# Altium schematic sheet CW308_IMXRT1062_UFO.SchDoc: CW308 Connections
size Letter; Organization: NewAE Technology Inc.; Address1: 1083 Queen St., Suite 196; Address2: Halifax; Address3: NS; Address4: Canada B3H 0B2; SheetNumber: 2; SheetTotal: 2; SheetApproved: NO
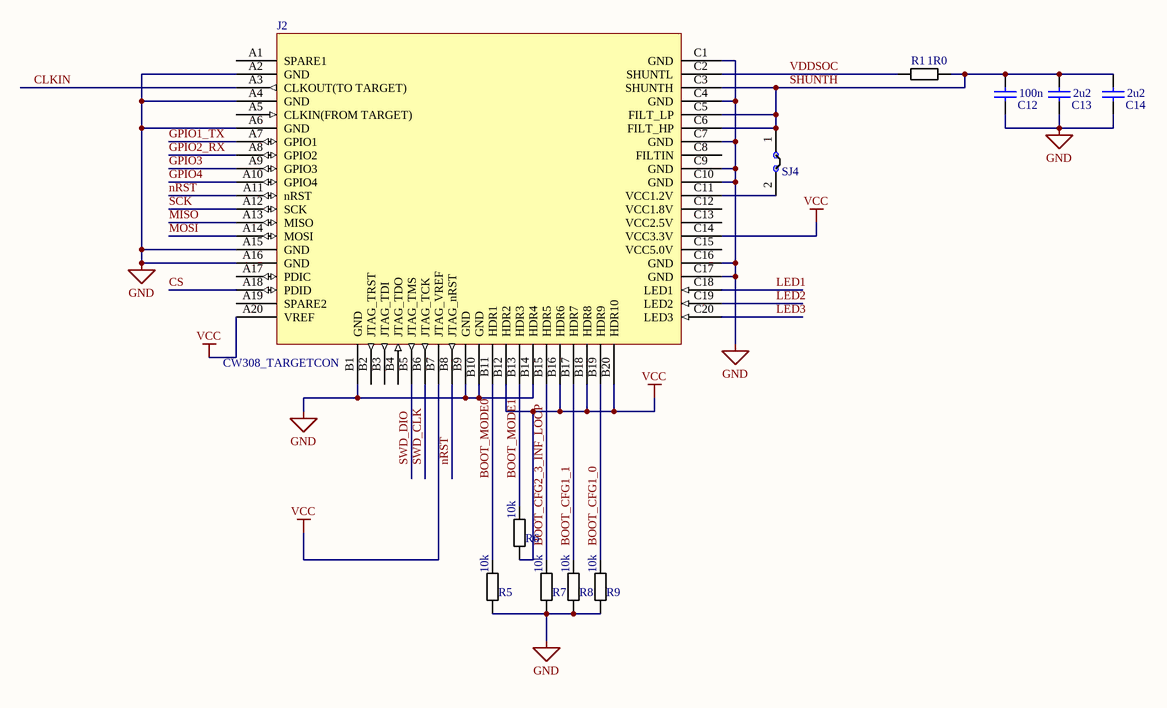
[diagram p0: CW308_IMXRT1062_UFO.SchDoc]

## Parts
C12  100n  [CAPC0603_M]
C13  2u2  [CAPC0603_M]
C14  2u2  [CAPC0603_M]
J2  CW308_TARGETCON  [CW308_TBOARD_CONN]
R1  1R0  [RESC1608X55N]
R5  10k  [RESC1608X55N]
R6  10k  [RESC1608X55N]
R7  10k  [RESC1608X55N]
R8  10k  [RESC1608X55N]
R9  10k  [RESC1608X55N]
SJ4  NC  [SJ_2S_NC]  (value not drawn)  (no BOM)

## Nets
GND: C12.2 C13.2 C14.2 J2.A2(GND) J2.A4(GND) J2.A6(GND) J2.A15(GND) J2.A16(GND) J2.B1(GND) J2.B9(GND) J2.B10(GND) J2.B14(HDR4) J2.C1(GND) J2.C4(GND) J2.C7(GND) J2.C9(GND) J2.C10(GND) J2.C16(GND) J2.C17(GND) R5.2 R7.2 R8.2 R9.1
VCC: J2.A20(VREF) J2.B7(JTAG_VREF) J2.B12(HDR2) J2.B16(HDR6) J2.B18(HDR8) J2.B20(HDR10) J2.C14(VCC3.3V) R6.2
BOOT_CFG1_0: J2.B19(HDR9) R9.2
BOOT_CFG1_1: J2.B17(HDR7) R8.1
BOOT_CFG2_3_INF_LOOP: J2.B15(HDR5) R7.1
BOOT_MODE0: J2.B11(HDR1) R5.1
BOOT_MODE1: J2.B13(HDR3) R6.1
CLKIN: J2.A3(CLKOUT(TO_TARGET))
CS: J2.A18(PDID)
GPIO1_TX: J2.A7(GPIO1)
GPIO2_RX: J2.A8(GPIO2)
GPIO3: J2.A9(GPIO3)
GPIO4: J2.A10(GPIO4)
LED1: J2.C18(LED1)
LED2: J2.C19(LED2)
LED3: J2.C20(LED3)
MISO: J2.A13(MISO)
MOSI: J2.A14(MOSI)
nRST: J2.A11(nRST) J2.B8(JTAG_nRST)
SCK: J2.A12(SCK)
SHUNTH: C12.1 C13.1 C14.1 J2.C3(SHUNTH) J2.C5(FILT_LP) J2.C6(FILT_HP) R1.2 SJ4.1
SWD_CLK: J2.B6(JTAG_TCK)
SWD_DIO: J2.B5(JTAG_TMS)
VDDSOC: J2.C2(SHUNTL) R1.1
NetJ2_C11: J2.C11(VCC1.2V) SJ4.2

Not connected (* = marked no-connect by the designer): J2 A1(SPARE1) A5(CLKIN(FROM_TARGET)) A17(PDIC) A19(SPARE2) B2(JTAG_TRST) B3(JTAG_TDI) B4(JTAG_TDO) C8(FILTIN) C12(VCC1.8V) C13(VCC2.5V) C15(VCC5.0V)

## Notes on the sheet
- Title:
- Date:
- Rev:
- Time:
- Project:
- Sheet
- of
- License:
- Copyright © NewAE Technology Inc.
- Approved:
- NewAE.com
- File:

## Library data of the parts
C12 = CCHIP-100n-0603: 100n, 0603; Manufacture 1: Kemet; Manufacture Part Number 1: C0603C104K5RACTU; Component Group: Capacitor; Case-EIA: 0603; Case-Metric: 1608; Rated Voltage: 50VDC; Part Number: CCHIP-100n-0603; Footprint: 0603; Pin Count: 2; Supplier 1: Digi-Key; Supplier Part Number 1: 399-5089-2-ND; Value: 100n; Mounting Technology: SMT; Component Kind: Standard; Component Type: Standard
C13 C14 = CCHIP-2u2-0603: 2u2, 0603; Manufacture 1: Samsung; Manufacture Part Number 1: CL10B225KP8NNNC; Component Group: Capacitor; Case-EIA: 0603; Case-Metric: 1608; Rated Voltage: 10VDC; Part Number: CCHIP-2u2-0603; Footprint: 0603; Pin Count: 2; Supplier 1: Digi-Key; Supplier Part Number 1: 1276-1134-2-ND; Value: 2u2; Mounting Technology: SMT; Component Kind: Standard; Component Type: Standard
J2 = CW308_TBOARD: CW308 "Standard" Target Board Connector; Component Group: Mechanical; Pitch: 2.54mm; Part Number: CW308_TBOARD; Pin Count: 60; Mounting Technology: Through-hole; Component Kind: Standard; Component Type: Standard
R1 = RCHIP-1R0-0603: 1R0 res, 0603, 1%, 1/10W; Manufacture 1: Yageo; Manufacture Part Number 1: RC0603FR-071RL; Component Group: Resistor; Case-EIA: 0603; Case-Metric: 1608; Rated Power: 0.1W; Rated Voltage: 75VDC; Part Number: RCHIP-1R0-0603; Footprint: 0603; Pin Count: 2; Supplier 1: Digi-Key; Supplier Part Number 1: 311-1.00HRCT-ND; Value: 1R0; Tolerance: 1%; Mounting Technology: SMT; Temperature Range: -55C to 155C; Component Kind: Standard; Component Type: Standard
R5-R9 = RCHIP-10K-0603: 10k res, 0603, 1%, 1/10W; Manufacture 1: Yageo; Manufacture Part Number 1: RC0603FR-0710KL; Component Group: Resistor; Case-EIA: 0603; Case-Metric: 1608; Rated Power: 0.1W; Rated Voltage: 75VDC; Part Number: RCHIP-10K-0603; Footprint: 0603; Pin Count: 2; Supplier 1: Digi-Key; Supplier Part Number 1: 311-10.0KHRCT-ND; Value: 10k; Tolerance: 1%; Mounting Technology: SMT; Temperature Range: -55C to 155C; Component Kind: Standard; Component Type: Standard
SJ4 = SJ_2S: Solder Jumper, NC; Component Group: PCB Feature; Part Number: SJ_2S; Pin Count: 2; Mounting Technology: COPPER; Component Type: Standard (No BOM)